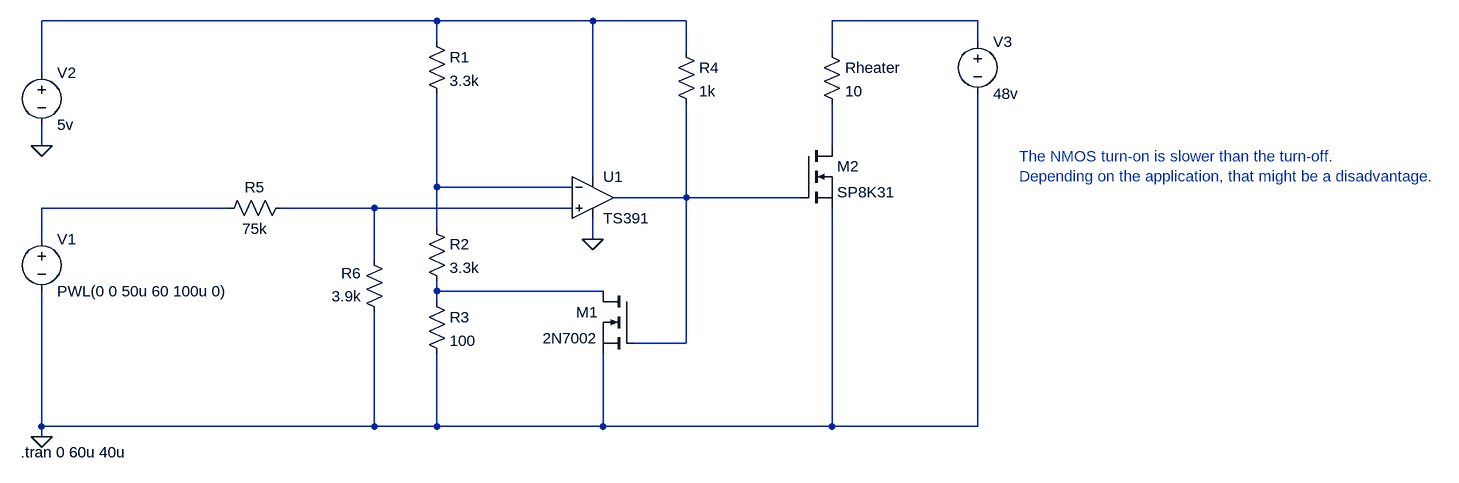
[diagram p0: schematic non-inverting-comparator_TS391.asc]
non-inverting-comparator_TS391.asc, the LTspice schematic file:
Version 4
SHEET 1 1552 680
WIRE -48 -64 -656 -64
WIRE 192 -64 -48 -64
WIRE 336 -64 192 -64
WIRE 784 -64 560 -64
WIRE -48 -32 -48 -64
WIRE 784 -32 784 -64
WIRE 336 -16 336 -64
WIRE 560 -16 560 -64
WIRE -656 16 -656 -64
WIRE -656 128 -656 96
WIRE 560 128 560 64
WIRE 192 176 192 -64
WIRE -48 192 -48 48
WIRE 160 192 -48 192
WIRE 336 208 336 64
WIRE 336 208 224 208
WIRE 512 208 336 208
WIRE -368 224 -656 224
WIRE -144 224 -288 224
WIRE 160 224 -144 224
WIRE -48 256 -48 192
WIRE -656 272 -656 224
WIRE 192 272 192 240
WIRE -144 304 -144 224
WIRE -48 352 -48 336
WIRE 208 352 -48 352
WIRE -48 368 -48 352
WIRE 336 432 336 208
WIRE 336 432 256 432
WIRE -656 560 -656 352
WIRE -144 560 -144 384
WIRE -144 560 -656 560
WIRE -48 560 -48 448
WIRE -48 560 -144 560
WIRE 208 560 208 448
WIRE 208 560 -48 560
WIRE 560 560 560 224
WIRE 560 560 208 560
WIRE 784 560 784 48
WIRE 784 560 560 560
WIRE -656 576 -656 560
FLAG 192 272 0
FLAG -656 576 0
FLAG -656 128 0
SYMBOL Parts_TCO\\TS391 192 144 R0
SYMATTR InstName U1
SYMBOL voltage -656 256 R0
WINDOW 123 0 0 Left 0
WINDOW 39 0 0 Left 0
SYMATTR InstName V1
SYMATTR Value PWL(0 0 50u 60 100u 0)
SYMBOL voltage -656 0 R0
SYMATTR InstName V2
SYMATTR Value 5v
SYMBOL res -64 -48 R0
SYMATTR InstName R1
SYMATTR Value 3.3k
SYMBOL res -64 240 R0
SYMATTR InstName R2
SYMATTR Value 3.3k
SYMBOL res -64 352 R0
SYMATTR InstName R3
SYMATTR Value 100
SYMBOL nmos 256 352 M0
SYMATTR InstName M1
SYMATTR Value 2N7002
SYMBOL res 320 -32 R0
SYMATTR InstName R4
SYMATTR Value 1k
SYMBOL res -272 208 R90
WINDOW 0 0 56 VBottom 2
WINDOW 3 32 56 VTop 2
SYMATTR InstName R5
SYMATTR Value 75k
SYMBOL res -128 400 R180
WINDOW 0 36 76 Left 2
WINDOW 3 36 40 Left 2
SYMATTR InstName R6
SYMATTR Value 3.9k
SYMBOL nmos 512 128 R0
SYMATTR InstName M2
SYMATTR Value SP8K31
SYMBOL res 544 -32 R0
SYMATTR InstName Rheater
SYMATTR Value 10
SYMBOL voltage 784 -48 R0
SYMATTR InstName V3
SYMATTR Value 48v
TEXT -688 600 Left 2 !.tran 0 60u 40u
TEXT 848 144 Left 2 ;The NMOS turn-on is slower than the turn-off.\nDepending on the application, that might be a disadvantage.

The netlist it stands for:
* non-inverting-comparator_TS391.asc
* U1: TS391 (symbol Parts_TCO\TS391 not available, pins judged from their places): In+=N007 In-=N004 V+=N001 V-=0 OUT=N005
V1 N006 0 PWL(0 0 50u 60 100u 0)
V2 N001 0 5v
R1 N001 N004 3.3k
R2 N004 N008 3.3k
R3 N008 0 100
M1 N008 N005 0 0 2N7002
R4 N001 N005 1k
R5 N007 N006 75k
R6 0 N007 3.9k
M2 N003 N005 0 0 SP8K31
Rheater N002 N003 10
V3 N002 0 48v
.model NMOS NMOS
.model PMOS PMOS
.lib standard.mos
.tran 0 60u 40u
* The NMOS turn-on is slower than the turn-off.
* Depending on the application, that might be a disadvantage.
.backanno
.end